# Altium project 51dpj.PrjPCB
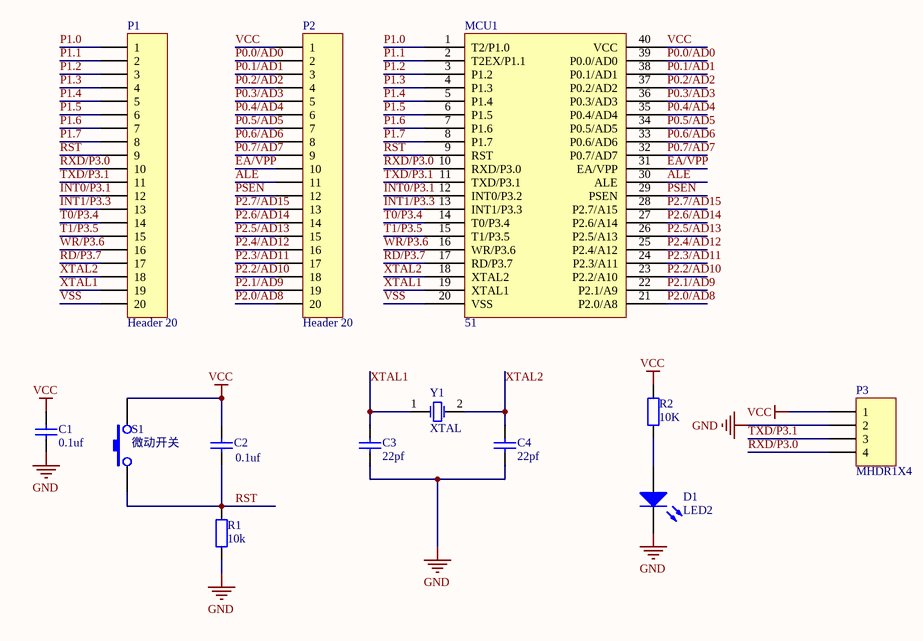
[diagram p0: 51.SchDoc]
1 sheet, 13 parts. Net scope: global (net labels, ports and power ports of the same name join across sheets).
Board file: 51.PcbDoc

## Sheet 51.SchDoc
size A4

### Parts
C1  0.1uf  [RB.15/.3]
C2  0.1uf  [0603]
C3  22pf  [RB.15/.3]
C4  22pf  [RB.15/.3]
D1  LED2  [3.2X1.6X1.1]
MCU1  51  [51-DIP40]
P1  Header 20  [HDR1X20]
P2  Header 20  [HDR1X20]
P3  MHDR1X4  [MHDR1X4]
R1  10k  [AXIAL0.4]
R2  10K  [0603]
S1  微动开关  [KEY]
Y1  XTAL  [XTAL1]

### Nets
GND: C1.1 C3.1 C4.1 D1.2(K) P3.2 R1.1
VCC: C1.2 C2.2 MCU1.40(VCC) P2.1 P3.1 R2.2 S1.2
ALE: MCU1.30(ALE) P2.11
EA/VPP: MCU1.31(EA/VPP) P2.10
INT0/P3.1: MCU1.12(INT0/P3.2) P1.12
INT1/P3.3: MCU1.13(INT1/P3.3) P1.13
P0.0/AD0: MCU1.39(P0.0/AD0) P2.2
P0.1/AD1: MCU1.38(P0.1/AD1) P2.3
P0.2/AD2: MCU1.37(P0.2/AD2) P2.4
P0.3/AD3: MCU1.36(P0.3/AD3) P2.5
P0.4/AD4: MCU1.35(P0.4/AD4) P2.6
P0.5/AD5: MCU1.34(P0.5/AD5) P2.7
P0.6/AD6: MCU1.33(P0.6/AD6) P2.8
P0.7/AD7: MCU1.32(P0.7/AD7) P2.9
P1.0: MCU1.1(T2/P1.0) P1.1
P1.1: MCU1.2(T2EX/P1.1) P1.2
P1.2: MCU1.3(P1.2) P1.3
P1.3: MCU1.4(P1.3) P1.4
P1.4: MCU1.5(P1.4) P1.5
P1.5: MCU1.6(P1.5) P1.6
P1.6: MCU1.7(P1.6) P1.7
P1.7: MCU1.8(P1.7) P1.8
P2.0/AD8: MCU1.21(P2.0/A8) P2.20
P2.1/AD9: MCU1.22(P2.1/A9) P2.19
P2.2/AD10: MCU1.23(P2.2/A10) P2.18
P2.3/AD11: MCU1.24(P2.3/A11) P2.17
P2.4/AD12: MCU1.25(P2.4/A12) P2.16
P2.5/AD13: MCU1.26(P2.5/A13) P2.15
P2.6/AD14: MCU1.27(P2.6/A14) P2.14
P2.7/AD15: MCU1.28(P2.7/A15) P2.13
PSEN: MCU1.29(PSEN) P2.12
RD/P3.7: MCU1.17(RD/P3.7) P1.17
RST: C2.1 MCU1.9(RST) P1.9 R1.2 S1.1
RXD/P3.0: MCU1.10(RXD/P3.0) P1.10 P3.4
T0/P3.4: MCU1.14(T0/P3.4) P1.14
T1/P3.5: MCU1.15(T1/P3.5) P1.15
TXD/P3.1: MCU1.11(TXD/P3.1) P1.11 P3.3
VSS: MCU1.20(VSS) P1.20
WR/P3.6: MCU1.16(WR/P3.6) P1.16
XTAL1: C3.2 MCU1.19(XTAL1) P1.19 Y1.1
XTAL2: C4.2 MCU1.18(XTAL2) P1.18 Y1.2
NetD1_1: D1.1(A) R2.1

### Library data of the parts
C1-C4 = C: 电容
D1 = LED2: Typical RED, GREEN, YELLOW, AMBER GaAs LED; Published: 8-Jun-2000; LatestRevisionDate: 17-Jul-2002; LatestRevisionNote: Re-released for DXP Platform.; PackageVersion: Feb-2002; PackageReference: 3.2X1.6X1.1; Publisher: Altium Limited; PackageDescription: SM LED; 2 Flat Leads
MCU1 = 51-DIP
P1 P2 = Header 20: Header, 20-Pin; LatestRevisionDate: 17-Jul-2002; LatestRevisionNote: Re-released for DXP Platform.; Publisher: Altium Limited
P3 = MHDR1X4: Header, 4-Pin; LatestRevisionDate: 17-Jul-2002; LatestRevisionNote: Re-released for DXP Platform.; Publisher: Altium Limited
R1 R2 = R: 电阻
Y1 = XTAL: 晶振